# Altium schematic sheet LEDCTRL.SchDoc
size A4
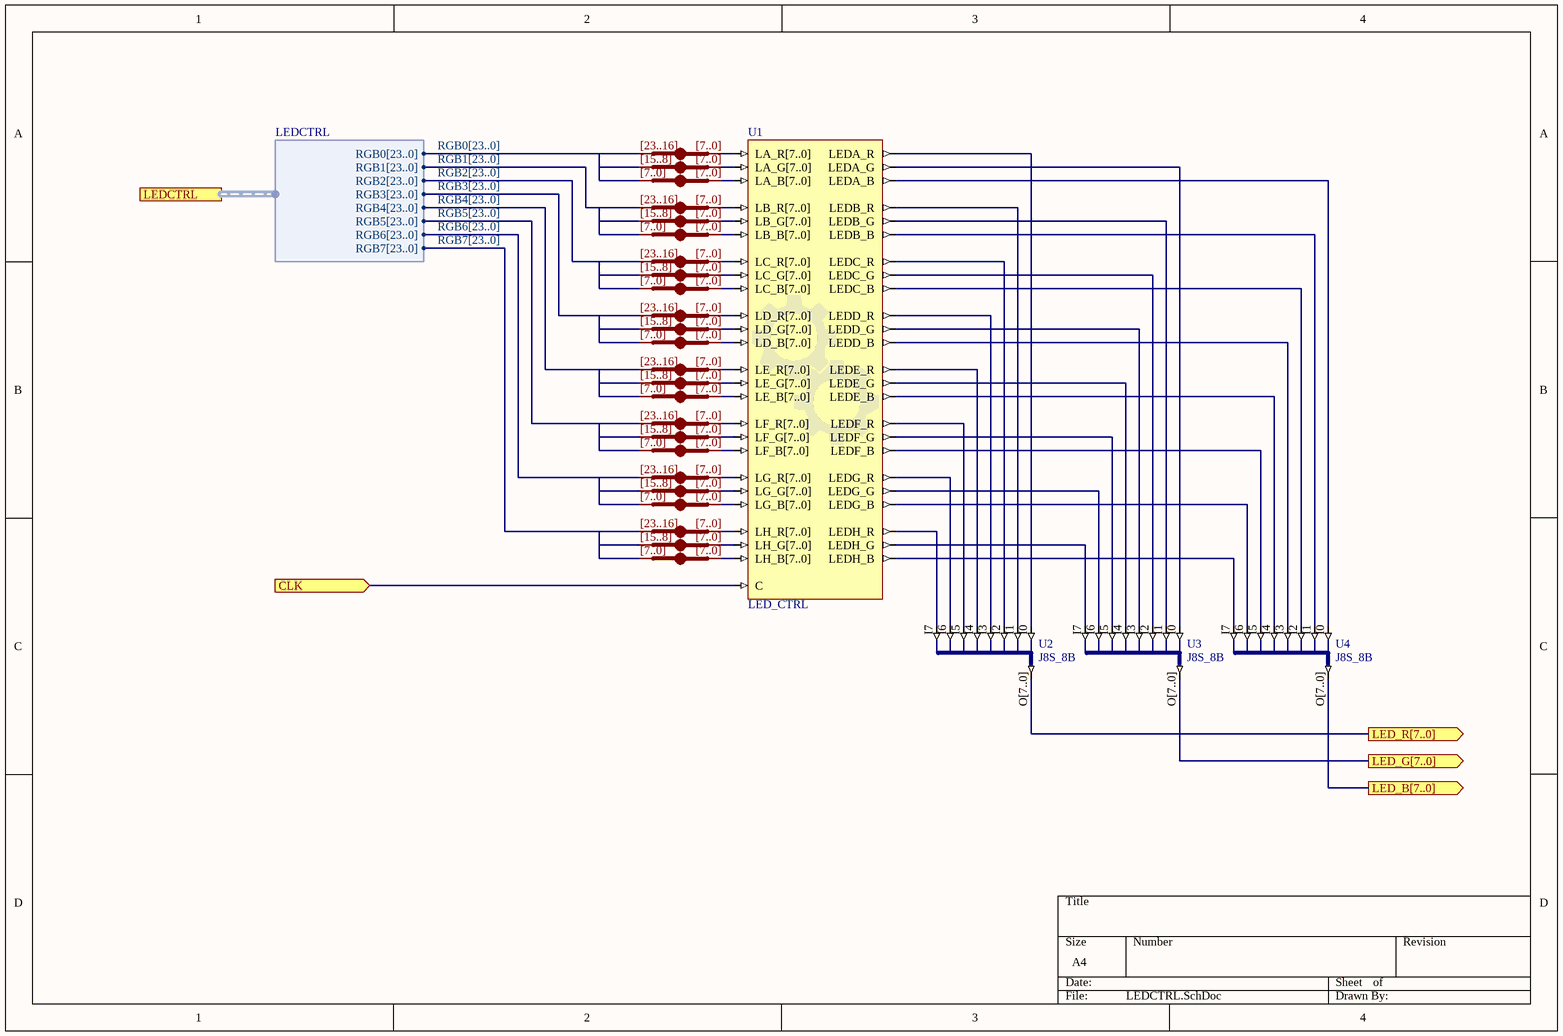
[diagram p0: LEDCTRL.SchDoc]

## Parts
(Parts that share a designator on the sheet are numbered #1, #2 ... from top to bottom, then left to right.)
JB_AUTO?#1  IndexA: [23..16]  IndexB: [7..0]  (hidden comment: JB)
JB_AUTO?#2  IndexA: [15..8]  IndexB: [7..0]  (hidden comment: JB)
JB_AUTO?#3  IndexA: [7..0]  (hidden comment: JB)
JB_AUTO?#4  IndexA: [23..16]  IndexB: [7..0]  (hidden comment: JB)
JB_AUTO?#5  IndexA: [15..8]  IndexB: [7..0]  (hidden comment: JB)
JB_AUTO?#6  IndexA: [7..0]  (hidden comment: JB)
JB_AUTO?#7  IndexA: [23..16]  IndexB: [7..0]  (hidden comment: JB)
JB_AUTO?#8  IndexA: [15..8]  IndexB: [7..0]  (hidden comment: JB)
JB_AUTO?#9  IndexA: [7..0]  (hidden comment: JB)
JB_AUTO?#10  IndexA: [23..16]  IndexB: [7..0]  (hidden comment: JB)
JB_AUTO?#11  IndexA: [15..8]  IndexB: [7..0]  (hidden comment: JB)
JB_AUTO?#12  IndexA: [7..0]  (hidden comment: JB)
JB_AUTO?#13  IndexA: [23..16]  IndexB: [7..0]  (hidden comment: JB)
JB_AUTO?#14  IndexA: [15..8]  IndexB: [7..0]  (hidden comment: JB)
JB_AUTO?#15  IndexA: [7..0]  (hidden comment: JB)
JB_AUTO?#16  IndexA: [23..16]  IndexB: [7..0]  (hidden comment: JB)
JB_AUTO?#17  IndexA: [15..8]  IndexB: [7..0]  (hidden comment: JB)
JB_AUTO?#18  IndexA: [7..0]  (hidden comment: JB)
JB_AUTO?#19  IndexA: [23..16]  IndexB: [7..0]  (hidden comment: JB)
JB_AUTO?#20  IndexA: [15..8]  IndexB: [7..0]  (hidden comment: JB)
JB_AUTO?#21  IndexA: [7..0]  (hidden comment: JB)
JB_AUTO?#22  IndexA: [23..16]  IndexB: [7..0]  (hidden comment: JB)
JB_AUTO?#23  IndexA: [15..8]  IndexB: [7..0]  (hidden comment: JB)
JB_AUTO?#24  IndexA: [7..0]  (hidden comment: JB)
U1  LED_CTRL
U2  J8S_8B
U3  J8S_8B
U4  J8S_8B

## Ports
CLK (in), LED_B[7..0] (out, harness LEDCTRL), LED_G[7..0] (out, harness LEDCTRL), LED_R[7..0] (out, harness LEDCTRL), LEDCTRL (harness LEDCTRL)

## Harnesses
LEDCTRL: RGB0[23..0], RGB1[23..0], RGB2[23..0], RGB3[23..0], RGB4[23..0], RGB5[23..0], RGB6[23..0], RGB7[23..0]

## Nets
CLK: U1.C ; port CLK
RGB0[23..0]: JB_AUTO?#1.A[0..0] JB_AUTO?#2.A[0..0] JB_AUTO?#3.A[0..0] ; port LEDCTRL.RGB0[23..0]
RGB1[23..0]: JB_AUTO?#4.A[0..0] JB_AUTO?#5.A[0..0] JB_AUTO?#6.A[0..0] ; port LEDCTRL.RGB1[23..0]
RGB2[23..0]: JB_AUTO?#7.A[0..0] JB_AUTO?#8.A[0..0] JB_AUTO?#9.A[0..0] ; port LEDCTRL.RGB2[23..0]
RGB3[23..0]: JB_AUTO?#10.A[0..0] JB_AUTO?#11.A[0..0] JB_AUTO?#12.A[0..0] ; port LEDCTRL.RGB3[23..0]
RGB4[23..0]: JB_AUTO?#13.A[0..0] JB_AUTO?#14.A[0..0] JB_AUTO?#15.A[0..0] ; port LEDCTRL.RGB4[23..0]
RGB5[23..0]: JB_AUTO?#16.A[0..0] JB_AUTO?#17.A[0..0] JB_AUTO?#18.A[0..0] ; port LEDCTRL.RGB5[23..0]
RGB6[23..0]: JB_AUTO?#19.A[0..0] JB_AUTO?#20.A[0..0] JB_AUTO?#21.A[0..0] ; port LEDCTRL.RGB6[23..0]
RGB7[23..0]: JB_AUTO?#22.A[0..0] JB_AUTO?#23.A[0..0] JB_AUTO?#24.A[0..0] ; port LEDCTRL.RGB7[23..0]
NetJB_AUTO?#1_B[0..0]: JB_AUTO?#1.B[0..0] U1.LA_R[7..0]
NetJB_AUTO?#2_B[0..0]: JB_AUTO?#2.B[0..0] U1.LA_G[7..0]
NetJB_AUTO?#3_B[0..0]: JB_AUTO?#3.B[0..0] U1.LA_B[7..0]
NetJB_AUTO?#4_B[0..0]: JB_AUTO?#4.B[0..0] U1.LB_R[7..0]
NetJB_AUTO?#5_B[0..0]: JB_AUTO?#5.B[0..0] U1.LB_G[7..0]
NetJB_AUTO?#6_B[0..0]: JB_AUTO?#6.B[0..0] U1.LB_B[7..0]
NetJB_AUTO?#7_B[0..0]: JB_AUTO?#7.B[0..0] U1.LC_R[7..0]
NetJB_AUTO?#8_B[0..0]: JB_AUTO?#8.B[0..0] U1.LC_G[7..0]
NetJB_AUTO?#9_B[0..0]: JB_AUTO?#9.B[0..0] U1.LC_B[7..0]
NetJB_AUTO?#10_B[0..0]: JB_AUTO?#10.B[0..0] U1.LD_R[7..0]
NetJB_AUTO?#11_B[0..0]: JB_AUTO?#11.B[0..0] U1.LD_G[7..0]
NetJB_AUTO?#12_B[0..0]: JB_AUTO?#12.B[0..0] U1.LD_B[7..0]
NetJB_AUTO?#13_B[0..0]: JB_AUTO?#13.B[0..0] U1.LE_R[7..0]
NetJB_AUTO?#14_B[0..0]: JB_AUTO?#14.B[0..0] U1.LE_G[7..0]
NetJB_AUTO?#15_B[0..0]: JB_AUTO?#15.B[0..0] U1.LE_B[7..0]
NetJB_AUTO?#16_B[0..0]: JB_AUTO?#16.B[0..0] U1.LF_R[7..0]
NetJB_AUTO?#17_B[0..0]: JB_AUTO?#17.B[0..0] U1.LF_G[7..0]
NetJB_AUTO?#18_B[0..0]: JB_AUTO?#18.B[0..0] U1.LF_B[7..0]
NetJB_AUTO?#19_B[0..0]: JB_AUTO?#19.B[0..0] U1.LG_R[7..0]
NetJB_AUTO?#20_B[0..0]: JB_AUTO?#20.B[0..0] U1.LG_G[7..0]
NetJB_AUTO?#21_B[0..0]: JB_AUTO?#21.B[0..0] U1.LG_B[7..0]
NetJB_AUTO?#22_B[0..0]: JB_AUTO?#22.B[0..0] U1.LH_R[7..0]
NetJB_AUTO?#23_B[0..0]: JB_AUTO?#23.B[0..0] U1.LH_G[7..0]
NetJB_AUTO?#24_B[0..0]: JB_AUTO?#24.B[0..0] U1.LH_B[7..0]
NetU1_LEDA_B: U1.LEDA_B U4.I0
NetU1_LEDA_G: U1.LEDA_G U3.I0
NetU1_LEDA_R: U1.LEDA_R U2.I0
NetU1_LEDB_B: U1.LEDB_B U4.I1
NetU1_LEDB_G: U1.LEDB_G U3.I1
NetU1_LEDB_R: U1.LEDB_R U2.I1
NetU1_LEDC_B: U1.LEDC_B U4.I2
NetU1_LEDC_G: U1.LEDC_G U3.I2
NetU1_LEDC_R: U1.LEDC_R U2.I2
NetU1_LEDD_B: U1.LEDD_B U4.I3
NetU1_LEDD_G: U1.LEDD_G U3.I3
NetU1_LEDD_R: U1.LEDD_R U2.I3
NetU1_LEDE_B: U1.LEDE_B U4.I4
NetU1_LEDE_G: U1.LEDE_G U3.I4
NetU1_LEDE_R: U1.LEDE_R U2.I4
NetU1_LEDF_B: U1.LEDF_B U4.I5
NetU1_LEDF_G: U1.LEDF_G U3.I5
NetU1_LEDF_R: U1.LEDF_R U2.I5
NetU1_LEDG_B: U1.LEDG_B U4.I6
NetU1_LEDG_G: U1.LEDG_G U3.I6
NetU1_LEDG_R: U1.LEDG_R U2.I6
NetU1_LEDH_B: U1.LEDH_B U4.I7
NetU1_LEDH_G: U1.LEDH_G U3.I7
NetU1_LEDH_R: U1.LEDH_R U2.I7

Not connected (* = marked no-connect by the designer): U2 O[7..0]; U3 O[7..0]; U4 O[7..0]

## Buses and harness runs
bus RGB0[23..0]
bus RGB1[23..0]
bus RGB2[23..0]
bus RGB3[23..0]
bus RGB4[23..0]
bus RGB5[23..0]
bus RGB6[23..0]
bus RGB7[23..0]

## Library data of the parts
JB_AUTO?#1-JB_AUTO?#24 = JB: System BUS Joiner; Published: 29-Jan-2004; Publisher: Altium Limited; LastRevisionNo: 1.00.00; HelpURL: CR0118 FPGA Generic Library Guide.pdf#page=297; FunctionalClass: Bus Joiner
  JB_AUTO?#3 JB_AUTO?#6 JB_AUTO?#9 JB_AUTO?#12 JB_AUTO?#15 JB_AUTO?#18 JB_AUTO?#21 JB_AUTO?#24: IndexB: [7..0]
U1 = LED_CTRL: Configurable LED Controller; ConfigurationParameters: {}Version[1.0]{}NumLEDs[8]{}IntensityControl[Individual]{}ConstantIntensity[10]{}BusEnOut[False]{}IsRGB[True]{}; LastRevisionNo: 1.00.00; Published: 27-Apr-2009; Publisher: Altium Limited; ConfiguratorName: LED_CTRL
U2-U4 = J8S_8B: 8 Single pin inputs to single 8-Bit output bus; FunctionalClass: Bus Joiner; PortSize: 8; ArchiveName: GENERIC; VHDLIB_SIM: GENERIC_LIB; Published: 29-Jan-2004; Publisher: Altium Limited; LastRevisionNo: 1.00.00; HelpURL: CR0118 FPGA Generic Library Guide.pdf#page=306; ComponentLink1URL: CR0126 FPGA Bus Joiner Resource Usage.pdf#page=28; ComponentLink1Description: Core &Resource Usage